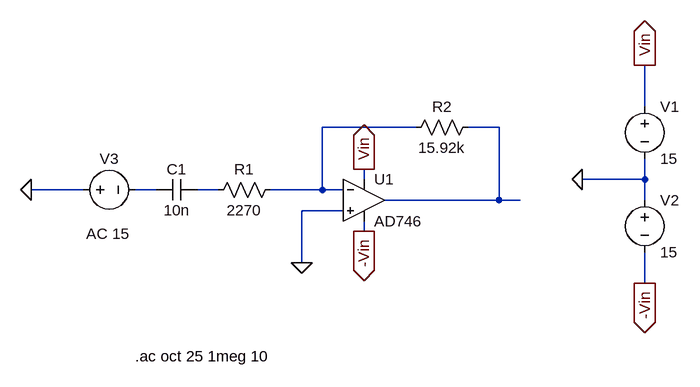
[diagram p0: schematic ФВЧ салена.asc]
ФВЧ салена.asc, the LTspice schematic file:
Version 4
SHEET 1 880 680
WIRE 608 32 608 -32
WIRE 256 64 112 64
WIRE 384 64 336 64
WIRE 176 144 176 128
WIRE 608 144 608 112
WIRE 608 144 512 144
WIRE -256 160 -336 160
WIRE -144 160 -176 160
WIRE -48 160 -80 160
WIRE 112 160 112 64
WIRE 112 160 32 160
WIRE 144 160 112 160
WIRE 384 176 384 64
WIRE 384 176 208 176
WIRE 416 176 384 176
WIRE 608 176 608 144
WIRE 144 192 80 192
WIRE 176 224 176 208
WIRE 80 272 80 192
WIRE 608 304 608 256
FLAG 512 144 0
FLAG 608 -32 Vin
IOPIN 608 -32 Out
FLAG 608 304 -Vin
IOPIN 608 304 Out
FLAG 176 128 Vin
IOPIN 176 128 Out
FLAG 176 224 -Vin
IOPIN 176 224 Out
FLAG -336 160 0
FLAG 80 272 0
SYMBOL Opamps\\AD746 176 112 R0
SYMATTR InstName U1
SYMBOL res 352 48 R90
WINDOW 0 0 56 VBottom 2
WINDOW 3 32 56 VTop 2
SYMATTR InstName R2
SYMATTR Value 15.92k
SYMBOL voltage 608 16 R0
SYMATTR InstName V1
SYMATTR Value 15
SYMBOL voltage 608 160 R0
SYMATTR InstName V2
SYMATTR Value 15
SYMBOL voltage -272 160 R270
WINDOW 0 32 56 VTop 2
WINDOW 3 -144 56 VBottom 2
WINDOW 123 -52 54 VBottom 2
WINDOW 39 0 0 Left 0
SYMATTR InstName V3
SYMATTR Value ""
SYMATTR Value2 AC 15
SYMBOL cap -80 144 R90
WINDOW 0 0 32 VBottom 2
WINDOW 3 32 32 VTop 2
SYMATTR InstName C1
SYMATTR Value 10n
SYMBOL res 48 144 R90
WINDOW 0 0 56 VBottom 2
WINDOW 3 32 56 VTop 2
SYMATTR InstName R1
SYMATTR Value 2270
TEXT -176 416 Left 2 !.ac oct 25 1meg 10

The netlist it stands for:
* ФВЧ салена.asc
XU1 0 N001 Vin -Vin N002 AD746  ; pins In+ In- V+ V- OUT
R2 N002 N001 15.92k
V1 Vin 0 15
V2 0 -Vin 15
V3 0 N003 AC 15
C1 N004 N003 10n
R1 N001 N004 2270
.ac oct 25 1meg 10
.backanno
.end